# Altium project MSXIV_PowerSelection.PrjPcb (part 2 of 2)

## Sheet Power Selection - AUX.SchDoc: Title
size B; Organization: Midnight Sun Solar Rayce Car Team; Address1: University of Waterloo; Address2: 200 University Ave W; Address3: Waterloo, ON, Canada; Address4: N2L 3E9; Website: www.uwmidsun.com; ProjectName: ProjectName
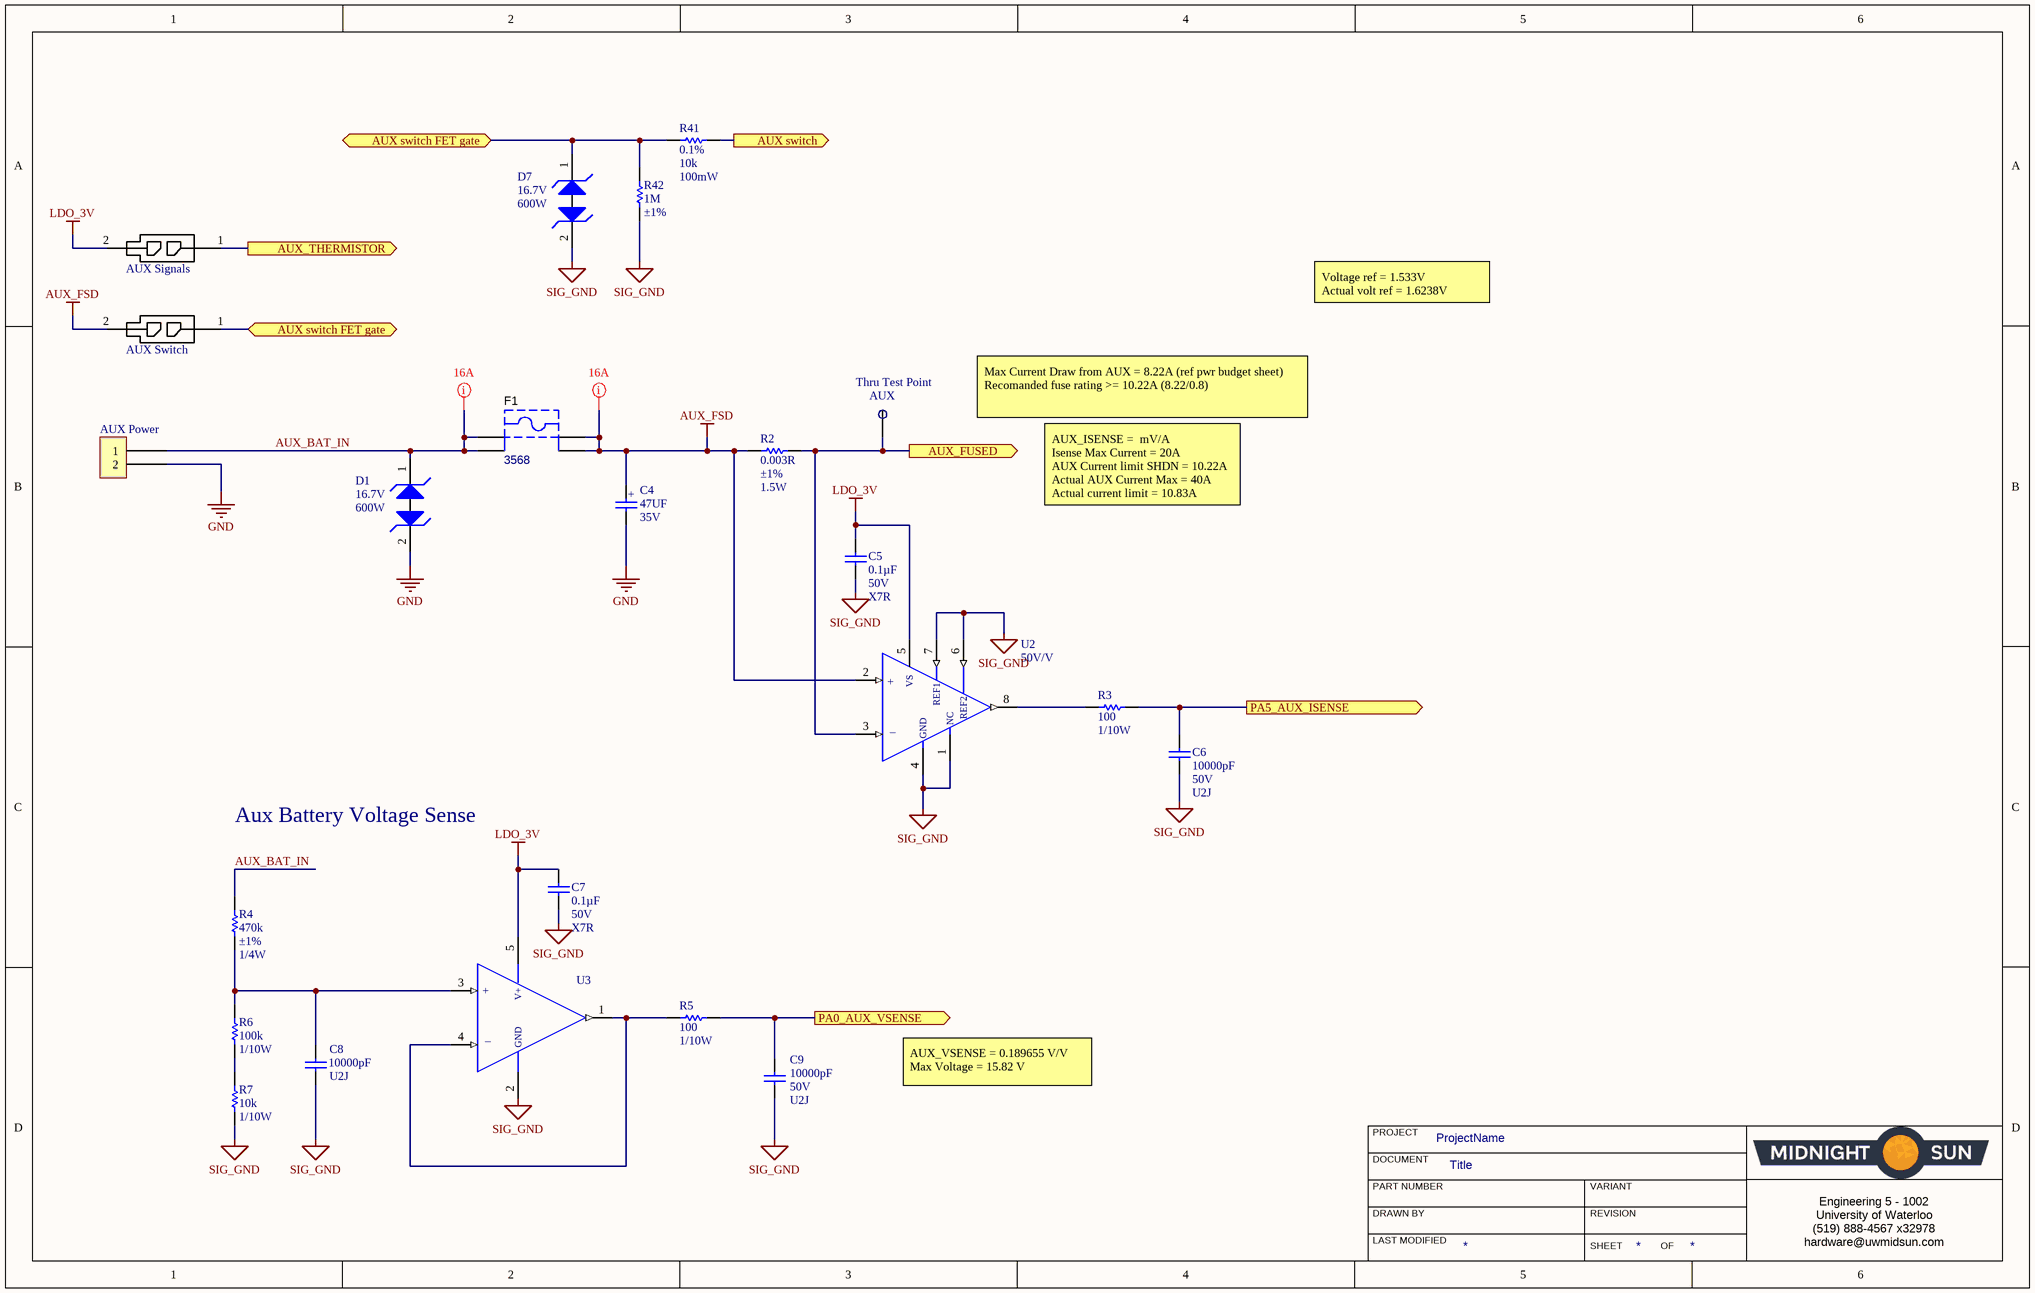
[diagram p3: Power Selection - AUX.SchDoc]

### Parts
AUX  Thru Test Point  [Thru Test Point]
AUX_Power  CONN HEADER TE  ELCON Mini 2POS PCB  [CONN HEADER TE  ELCON Mini 2POS PCB-Footprint-1]  (value not drawn)
AUX_Signals  CONN 2POS MICRO-FIT 3mm  [CONN, 2POS MICRO-FIT]  (value not drawn)
AUX_Switch  CONN 2POS MICRO-FIT 3mm  [CONN, 2POS MICRO-FIT]  (value not drawn)
C4  47UF  Voltage Rating: 35V  [CAP ALUM 6.3MM RADIAL SMD]
C5  Capacitance: 0.1µF  Voltage: 50V  Temperature Coefficient: X7R  [CAP, 0603]  (hidden comment: CAP CER 0.1UF 50V 10% X7R 0603)
C6  Capacitance: 10000pF  Voltage: 50V  Temperature Coefficient: U2J  [CAP, 0603]  (hidden comment: CAP CER 10nF 50V 5% X7R 0603)
C7  Capacitance: 0.1µF  Voltage: 50V  Temperature Coefficient: X7R  [CAP, 0603]  (hidden comment: CAP CER 0.1UF 50V 10% X7R 0603)
C8  Capacitance: 10000pF  Temperature Coefficient: U2J  [CAP, 0603]  (hidden comment: CAP CER 10nF 50V 5% X7R 0603)
C9  Capacitance: 10000pF  Voltage: 50V  Temperature Coefficient: U2J  [CAP, 0603]  (hidden comment: CAP CER 10nF 50V 5% X7R 0603)
D1  Voltage - Breakdown (Min): 16.7V  Power - Peak Pulse: 600W  [DO-214AA Diode]  (hidden comment: DIODE TVS 15VWM 24.4VC DO-214AA (SMB))
D7  Voltage - Breakdown (Min): 16.7V  Power - Peak Pulse: 600W  [DO-214AA Diode]  (hidden comment: DIODE TVS 15VWM 24.4VC DO-214AA (SMB))
F1  3568  [KSTN-3568_V]
R2  Resistance (Ohms): 0.003R  Tolerance: ±1%  Power (Watts): 1.5W  [RES 2010]  (hidden comment: RES 0.003 OHM 1% 1.5W 2010)
R3  Resistance: 100  Power: 1/10W  [RES, 0603]  (hidden comment: RES 100 OHM 1% 1/10W 0603)
R4  Resistance: 470k  Tolerance: ±1%  Power: 1/4W  [RES, 0603]  (hidden comment: RES 470K OHM 1% 1/4W 0603)
R5  Resistance: 100  Power: 1/10W  [RES, 0603]  (hidden comment: RES 100 OHM 1% 1/10W 0603)
R6  Resistance: 100k  Power: 1/10W  [RES, 0603]  (hidden comment: RES 100K OHM 5% 1/8W 0603)
R7  Resistance: 10k  Power: 1/10W  [RES, 0603]  (hidden comment: RES 10K OHM 1% 1/10W 0603)
R41  value 10k  Tolerance: 0.1%  Max Power Dissipation: 100mW  [RES, 0603]  (hidden comment: RES SMD 1K OHM 0.1% 1/10W 0603)
R42  Resistance (Ohms): 1M  Tolerance: ±1%  [RES, 0603]  (hidden comment: RES 1M OHM 1% 1/10W 0603)
U2  50V/V  [IC CURRENT AMPLIFIER INA240 TSSOP-8]
U3  IC OP AMP GEN PURPOSE RR 10MHZ SOT-23-5  [IC OP AMP GP RR 10MHZ SOT-23-5]  (value not drawn)

### Ports
AUX switch (out), AUX switch FET gate (bidir), AUX_FUSED (out), AUX_THERMISTOR (out), PA0_AUX_VSENSE (out), PA5_AUX_ISENSE (out)

### Nets
AUX_FSD: AUX_Switch.2 C4.1 F1.3 F1.4 R2.1 U2.2(+IN)
GND: AUX_Power.2 C4.2 D1.2(Cathode2)
LDO_3V: AUX_Signals.2 C5.1 C7.1 U2.5(VS) U3.5(VDD)
SIG_GND: C5.2 C6.2 C7.2 C8.2 C9.2 D7.2(Cathode2) R7.2 R42.2 U2.1(NC) U2.4(GND) U2.6(REF2) U2.7(REF1) U3.2(VSS)
AUX_BAT_IN: AUX_Power.1 D1.1(Cathode1) F1.1 F1.2 R4.1
AUX_FUSED: AUX.TH_TP R2.2 U2.3(-IN) ; port AUX_FUSED
PA0_AUX_VSENSE: C9.1 R5.2 ; port PA0_AUX_VSENSE
PA5_AUX_ISENSE: C6.1 R3.2 ; port PA5_AUX_ISENSE
NetAUX_Signals_1: AUX_Signals.1 ; port AUX_THERMISTOR
NetAUX_Switch_1: AUX_Switch.1 D7.1(Cathode1) R41.1 R42.1 ; port AUX switch FET gate
NetC8_1: C8.1 R4.2 R6.1 U3.3(+IN)
NetQ14_1: R41.2 ; port AUX switch
NetR3_1: R3.1 U2.8(OUTPUT)
NetR5_1: R5.1 U3.1(OUTPUT) U3.4(-IN)
NetR6_2: R6.2 R7.1

### Layout directives
net class HighCurrent; rule Power Plane Connect Style [Style - Direct Connect]; rule Polygon Connect Style [Style - Direct Connect]: AUX_BAT_IN, AUX_FSD

### Notes on the sheet
- Voltage ref = 1.533V
  Actual volt ref = 1.6238V
- Max Current Draw from AUX = 8.22A (ref pwr budget sheet)
  Recomanded fuse rating >= 10.22A (8.22/0.8)
- AUX_ISENSE =  mV/A
  Isense Max Current = 20A
  AUX Current limit SHDN = 10.22A
  Actual AUX Current Max = 40A
  Actual current limit = 10.83A
- Aux Battery Voltage Sense
- AUX_VSENSE = 0.189655 V/V
  Max Voltage = 15.82 V
- PROJECT
- DOCUMENT
- DRAWN BY
- LAST MODIFIED
- PART NUMBER
- REVISION
- SHEET
- VARIANT
- OF
- Engineering 5 - 1002
  University of Waterloo
  (519) 888-4567 x32978
  hardware@uwmidsun.com
- (in symbol CAP ALUM 47UF 20% 35V SMD) +
- (in symbol IC CURRENT AMPLIFIER INA240 8-TSSOP) +; _
- (in symbol IC OP AMP GEN PURPOSE RR 10MHZ SOT-23-5) V+; +; GND; _

### Library data of the parts
AUX_Power = CMP-002-00071-4: CONN HEADER 2POS PCB; Contact Current Rating: 40A; Number of Contacts: 2; Pitch: 7.8mm; Contact Retention: Yes (With); Sealable: No (Without); Current Rating: 45A; Circuit Application: Power; Gender: Male; Connector Type: Pin; PCB Mounting Orientation: Vertical; Number of Ports: 1; Connector System: Wire-to-Board; Number of Rows: 1; Contact Plating: Silver; Housing Color: Black; Length: 18.9mm; Package Quantity: 150; Number of Terminals: 4; Orientation: Straight; REACH SVHC: Unknown; Contact Material: Copper Alloy,Copper; Housing Material: Polymer; Depth: 10.2mm; Row Spacing: 7.8mm; Termination: Through Hole; Min Operating Temperature: -40°C; Number of Positions: 2; Contact Gender: Male; Packaging: Tape and Reel; Mount: Through Hole; Number of Power Positions: 2; Radiation Hardening: No; Flammability Rating: UL94 V-0; Max Operating Temperature: 125°C
AUX_Signals AUX_Switch = CONN 2POS MICRO-FIT 3mm: Connector Header Through Hole 2 position; Manufacturer: Molex; Manufacturer Part Number: 43045-0227; Number of Positions: 2; Gender: Male; Contact Resistance: 10mR; Number of Ports: 1; Max Voltage Rating (DC): 250.25kV; Current Rating: 5A; Voltage Rating: 600V; Glow Wire Compliant: Compliant; Supplier 1: Digi-Key; Stock 1: 3657; Pricing 1: 1=0.84, 10=0.74, 25=0.6968, 50=0.6676, 100=0.6387, 250=0.5806, 500=0.52254, 1000=0.46448, 2500=0.42094 (USD); Mount: Through Hole; Contact Plating: Tin; Contact Material: Brass; Housing Colour: Black; Housing Material: Thermoplastic; Number of Terminals: 2; Min Operating Temperature: -40°C; Max Operating Temperature: 105°C; Number of Rows: 2; Packaging: Tray; Termination: Solder; Number of Contacts: 2; Orientation: Vertical; Package Quantity: 3168; Number of Circuits: 2; Length: 7.15mm; Pitch: 3mm; Depth: 8.77mm; Row Spacing: 3mm; Radiation Hardening: No; Halogen Free: Low Halogen; ComponentLink1URL: http://www.onlinecomponents.com/productFiles/mf-MOL/307170430450227_pcb_headers.pdf; ComponentLink1Description: http://www.onlinecomponents.com/productFiles/mf-MOL/307170430450227_pcb_headers.pdf; ComponentLink2URL: http://www.mouser.com/ds/2/276/0430450227_PCB_HEADERS-142611.pdf; ComponentLink2Description: http://www.mouser.com/ds/2/276/0430450227_PCB_HEADERS-142611.pdf; ComponentLink3URL: http://uk.rs-online.com/webdocs/13c3/0900766b813c3a46.pdf; ComponentLink3Description: http://uk.rs-online.com/webdocs/13c3/0900766b813c3a46.pdf; ComponentLink4URL: http://www.molex.com/webdocs/datasheets/pdf/en-us/0430450227_PCB_HEADERS.pdf; ComponentLink4Description: http://www.molex.com/webdocs/datasheets/pdf/en-us/0430450227_PCB_HEADERS.pdf; Supplier Part Number 1: WM10657-ND
C4 = CAP ALUM 47UF 20% 35V SMD: 47µF 35V Aluminum Electrolytic Capacitors Radial, Can - SMD 1000 Hrs @ 85°C; Manufacturer: Panasonic; Manufacturer Part Number: EEE-1VA470WP; Tolerance: 20%; Ripple Current: 70mA; Life (Hours): 1000Hour; Supplier 1: Digi-Key; Stock 1: 2820; Pricing 1: 1=0.38, 10=0.263, 100=0.1579, 500=0.11846 (USD); Mount: Surface Mount,PCB; Case/Package: Radial; Contact Plating: Tin; Min Operating Temperature: -40°C; Max Operating Temperature: 85°C; Capacitance: 47uF; Voltage Rating (DC): 35V; Packaging: Tape and Reel; Package Quantity: 1; Ripple Current (AC): 70mA; Termination: SMD/SMT; Diameter: 6.3mm; Length: 5.5mm; Height: 5.4mm; Height - Seated (Max): 0.213inch; Radiation Hardening: No; REACH SVHC: Unknown; Lead Free: Lead Free; ComponentLink1URL: https://datasheet.ciiva.com/2983/aba0000ce2-2983926.pdf; ComponentLink1Description: https://datasheet.ciiva.com/2983/aba0000ce2-2983926.pdf; ComponentLink2URL: https://datasheet.ciiva.com/2983/aba0000ce2-2983927.pdf; ComponentLink2Description: https://datasheet.ciiva.com/2983/aba0000ce2-2983927.pdf; ComponentLink3URL: https://datasheet.ciiva.com/14598/70255710-14598937.pdf; ComponentLink3Description: https://datasheet.ciiva.com/14598/70255710-14598937.pdf; ComponentLink4URL: https://datasheet.ciiva.com/15165/getdatasheetpartid-86239-15165868.pdf; ComponentLink4Description: https://datasheet.ciiva.com/15165/getdatasheetpartid-86239-15165868.pdf; ComponentLink5URL: https://datasheet.ciiva.com/16507/aba0000ce2-16507965.pdf; ComponentLink5Description: https://datasheet.ciiva.com/16507/aba0000ce2-16507965.pdf; ComponentLink6URL: https://datasheet.ciiva.com/30206/11aba0000ce2-30206253.pdf; ComponentLink6Description: https://datasheet.ciiva.com/30206/11aba0000ce2-30206253.pdf; Supplier Part Number 1: PCE3961CT-ND
C5 C7 = CAP CER 0.1UF 50V 10% X7R 0603: 0.10µF ±10% 50V Ceramic Capacitor X7R 0603 (1608 Metric); Manufacturer 1: AVX Corporation; Manufacturer Part Number 1: 06035C104KAT2A; Supplier 1: Digi-Key; Supplier Part Number 1: 478-5052-1-ND; Packaging: Cut Tape (CT); Part Status: Active; Operating Temperature: -55°C ~ 125°C; Ratings: -; Mounting Type: Surface Mount, MLCC; Package / Case: 0603 (1608 Metric); Size / Dimension: 0.063" L x 0.032" W (1.60mm x 0.81mm); Height - Seated (Max): -; Thickness (Max): 0.035" (0.90mm); Lead Spacing: -; Lead Style: -; ComponentLink1URL: http://datasheets.avx.com/X7RDielectric.pdf; ComponentLink1Description: http://datasheets.avx.com/X7RDielectric.pdf; Tolerance: ±10%
C6 C8 C9 = CAP CER 10nF 50V 5% X7R 0603: 10000pF ±5% 50V Ceramic Capacitor U2J 0603 (1608 Metric); Manufacturer 1: KEMET; Manufacturer Part Number 1: C0603C103J5JAC7867; Supplier 1: Digi-Key; Supplier Part Number 1: 399-13384-1-ND; Packaging: Cut Tape (CT); Part Status: Active; Operating Temperature: -55°C ~ 125°C; Ratings: -; Failure Rate: -; Mounting Type: Surface Mount, MLCC; Package / Case: 0603 (1608 Metric); Size / Dimension: 0.063" L x 0.032" W (1.60mm x 0.80mm); Height - Seated (Max): -; Thickness (Max): 0.034" (0.87mm); Lead Spacing: -; Lead Style: -; ComponentLink1URL: http://www.kemet.com/docfinder?Partnumber=C0603C103J5JAC7867; ComponentLink1Description: http://www.kemet.com/docfinder?Partnumber=C0603C103J5JAC7867; Tolerance: ±5%
  C8: Voltage: 50V
D1 D7 = DIODE TVS 15VWM 24.4VC DO-214AA (SMB): TVS DIODE 15VWM 24.4VC SMB; Manufacturer 1: Fairchild/ON Semiconductor; Manufacturer Part Number 1: SMBJ15CA; Type: Zener; Voltage - Reverse Standoff (Typ): 15V; Voltage - Clamping (Max) @ Ipp: 24.4V; Current - Peak Pulse (10/1000µs): 24.6A; Power Line Protection: No; Supplier 1: Digi-Key; Supplier Part Number 1: SMBJ15CAFSCT-ND; RoHS: RoHS Compliant; Description 1: TVS DIODE 15VWM 24.4VC SMB; Category: Circuit Protection; Stock 1: 24965; Pricing 1: 1=0.54, 10=0.444, 100=0.3027, 500=0.22704, 1000=0.17028 (CAD); Packaging: Cut Tape (CT); Part Status: Active; Applications: General Purpose; Capacitance @ Frequency: -; Operating Temperature: -55°C ~ 150°C (TJ); Mounting Type: Surface Mount; Package / Case: DO-214AA, SMB; Supplier Device Package: DO-214AA (SMB); ComponentLink1URL: https://www.fairchildsemi.com/datasheets/SM/SMBJ10CA.pdf; ComponentLink1Description: https://www.fairchildsemi.com/datasheets/SM/SMBJ10CA.pdf
F1 = CMP-005-00014-1: Fuse Holder 20A 500VAC Pin Through Hole; Illumination Type: Illuminated; Number of Poles: 1; Voltage: 500V; Color: Black; Approvals: UL; Fuse Type: Automotive; Body Material: Nylon; Material: Brass,Tin,Nylon; Fuse Current: 20A; REACH SVHC: No SVHC; Depth: 6.73mm; Current Rating: 20A; Length: 16mm; Flammability Rating: UL94 V-0; Mount: PCB,Vertical; Voltage Rating (AC): 500V; Contact Plating: Tin; Max Operating Temperature: 145°C; Min Operating Temperature: -50°C; Lead Free: Lead Free; Package Quantity: 1; Number of Circuits: 1; Termination: PC Pin; Orientation: Vertical; Contact Material: Brass,Tin
R2 = RES 0.003 OHM 1% 1.5W 2010: 0.003 Ohm ±1% 1.5W Chip Resistor 2010 (5025 Metric) Current Sense, Moisture Resistant Metal Foil; Manufacturer 1: Stackpole Electronics Inc.; Manufacturer Part Number 1: CSNL2010FT3L00; Description 1: RES SMD 0.003 OHM 1% 1.5W 2010; Temperature Coefficient: ±50ppm/°C; Supplier 1: Digi-Key; Supplier Part Number 1: CSNL2010FT3L00CT-ND; RoHS: RoHS Compliant; Category: Resistors; Stock 1: 18532; Pricing 1: 1=1.02, 10=0.844, 25=0.7232, 50=0.6508, 100=0.5665, 250=0.5062, 500=0.4098, 1000=0.33145 (CAD); Packaging: Cut Tape (CT); Part Status: Active; Composition: Metal Foil; Features: Current Sense, Moisture Resistant; Operating Temperature: -55°C ~ 170°C; Package / Case: 2010 (5025 Metric); Supplier Device Package: 2010; Size / Dimension: 0.200" L x 0.100" W (5.08mm x 2.54mm); Height - Seated (Max): 0.041" (1.04mm); Failure Rate: -; ComponentLink1URL: https://www.seielect.com/Catalog/SEI-csnl.pdf; ComponentLink1Description: https://www.seielect.com/Catalog/SEI-csnl.pdf
R3 R5 = RES 100 OHM 1% 1/10W 0603: 100 Ohm ±1% 0.1W, 1/10W Chip Resistor 0603 (1608 Metric) Moisture Resistant Thick Film; Manufacturer 1: Yageo; Manufacturer Part Number 1: RC0603FR-07100RL; Temperature Coefficient: ±100ppm/°C; Supplier 1: Digi-Key; Supplier Part Number 1: 311-100HRCT-ND; Packaging: Cut Tape (CT); Part Status: Active; Composition: Thick Film; Operating Temperature: -55°C ~ 155°C; Package / Case: 0603 (1608 Metric); Supplier Device Package: 0603; Size / Dimension: 0.063" L x 0.031" W (1.60mm x 0.80mm); Height - Seated (Max): 0.022" (0.55mm); Failure Rate: -; ComponentLink1URL: http://www.yageo.com/documents/recent/PYu-RC_Group_51_RoHS_L_7.pdf; ComponentLink1Description: http://www.yageo.com/documents/recent/PYu-RC_Group_51_RoHS_L_7.pdf; Tolerance: ±1%
R4 = RES 470K OHM 1% 1/4W 0603: RES SMD 470K OHM 1% 1/4W 0603; Manufacturer 1: Panasonic Electronic Components; Manufacturer Part Number 1: ERJ-PA3F4703V; Temperature Coefficient: ±100ppm/°C; Supplier 1: Digi-Key; Supplier Part Number 1: P470KBYCT-ND; Packaging: Cut Tape (CT); Part Status: Active; Composition: Thick Film; Operating Temperature: -55°C ~ 155°C; Package / Case: 0603 (1608 Metric); Supplier Device Package: 0603; Size / Dimension: 0.063" L x 0.031" W (1.60mm x 0.80mm); Height - Seated (Max): 0.022" (0.55mm); Failure Rate: -; ComponentLink1URL: https://industrial.panasonic.com/cdbs/www-data/pdf/RDO0000/AOA0000C291.pdf; ComponentLink1Description: https://industrial.panasonic.com/cdbs/www-data/pdf/RDO0000/AOA0000C291.pdf
R6 = RES 100K OHM 5% 1/8W 0603: RES SMD 100K OHM 5% 1/10W 0603; Manufacturer 1: Yageo; Manufacturer Part Number 1: RC0603JR-07100KL; Temperature Coefficient: ±100ppm/°C; Supplier 1: Digi-Key; Supplier Part Number 1: 311-100KGRCT-ND; Packaging: Cut Tape (CT); Part Status: Active; Composition: Thick Film; Operating Temperature: -55°C ~ 155°C; Package / Case: 0603 (1608 Metric); Supplier Device Package: 0603; Size / Dimension: 0.063" L x 0.031" W (1.60mm x 0.80mm); Height - Seated (Max): 0.022" (0.55mm); Failure Rate: -; ComponentLink1URL: http://www.yageo.com/documents/recent/PYu-RC_Group_51_RoHS_L_7.pdf; ComponentLink1Description: http://www.yageo.com/documents/recent/PYu-RC_Group_51_RoHS_L_7.pdf; Tolerance: ±5%
R7 = RES 10K OHM 1% 1/10W 0603: RES SMD 10K OHM 1% 1/10W 0603; Manufacturer 1: Yageo; Manufacturer Part Number 1: RC0603FR-0710KL; Temperature Coefficient: ±100ppm/°C; Supplier 1: Digi-Key; Supplier Part Number 1: 311-10.0KHRCT-ND; Packaging: Cut Tape (CT); Part Status: Active; Composition: Thick Film; Operating Temperature: -55°C ~ 155°C; Package / Case: 0603 (1608 Metric); Supplier Device Package: 0603; Size / Dimension: 0.063" L x 0.031" W (1.60mm x 0.80mm); Height - Seated (Max): 0.022" (0.55mm); Failure Rate: -; ComponentLink1URL: http://www.yageo.com/documents/recent/PYu-RC_Group_51_RoHS_L_7.pdf; ComponentLink1Description: http://www.yageo.com/documents/recent/PYu-RC_Group_51_RoHS_L_7.pdf; Tolerance: ±1%
R41 = CMP-010-0039-1: 1 kOhms ��0.1% 0.1W, 1/10W Chip Resistor 0603 (1608 Metric) Automotive AEC-Q200 Thin Film; Manufacturer: Panasonic; Manufacturer Part Number: ERA3AEB103V; Voltage Rating: 75V; Temperature Coefficient: 25ppm/��C; Power Rating: 100mW; Number of Terminations: 2; Mount: Surface Mount; Packaging: Tape and Reel; RoHS: Yes; Termination: SMD/SMT; ComponentLink7Description: http://www.farnell.com/datasheets/2059650.pdf; Military Standard: Not; Stock 1: 2747820; ComponentLink6URL: http://uk.rs-online.com/webdocs/148c/0900766b8148c4ab.pdf; Lead Free: Lead Free; Pins: 2; ComponentLink4Description: http://www.farnell.com/datasheets/2052875.pdf; Source: Schematic Diagrams.SchLib; Case Code (Metric): 1608; ComponentLink3URL: http://industrial.panasonic.com/www-data/pdf/AOA0000/AOA0000CE26.pdf; ComponentLink8URL: http://www.produktinfo.conrad.com/datenblaetter/450000-474999/451250-da-01-en-WIDERSTAND_0603_ERA.pdf; Depth: 0.8mm; Max Operating Temperature: 155��C; Case/Package: 0603; ComponentLink2Description: http://www.farnell.com/datasheets/485442.pdf; Package Quantity: 5000; Contact Plating: Tin; Width: 0.8mm; ComponentLink7URL: http://www.farnell.com/datasheets/2059650.pdf; Design Item ID: RES SMD 1K OHM 0.1% 1/10W 0603; ComponentLink4URL: http://www.farnell.com/datasheets/2052875.pdf; Radiation Hardening: No; Pricing 1: 1 = 0.35000, 10 = 0.30000, 100 = 0.11720, 1000 = 0.04906, 2500 = 0.04498 (USD); ComponentLink5URL: http://www.farnell.com/datasheets/1776116.pdf; Height: 0.45mm; ComponentLink2URL: http://www.farnell.com/datasheets/485442.pdf; ComponentLink3Description: http://industrial.panasonic.com/www-data/pdf/AOA0000/AOA0000CE26.pdf; ComponentLink1Description: Digikey; ComponentLink8Description: http://www.produktinfo.conrad.com/datenblaetter/450000-474999/451250-da-01-en-WIDERSTAND_0603_ERA.pdf; Voltage Rating (DC): 75V; ComponentLink5Description: http://www.farnell.com/datasheets/1776116.pdf; Composition: Metal Film,Thin Film; Min Operating Temperature: -55��C; Length: 1.6mm; REACH SVHC: No SVHC; ComponentLink6Description: http://uk.rs-online.com/webdocs/148c/0900766b8148c4ab.pdf; ComponentLink1URL: https://www.digikey.ca/product-detail/en/panasonic-electronic-components/ERA-3AEB102V/P1.0KDBCT-ND/1466052
R42 = RES 1M OHM 1% 1/10W 0603: 1M Ohm ±1% 0.1W, 1/10W Chip Resistor 0603 (1608 Metric) Moisture Resistant Thick Film; Manufacturer 1: Yageo; Manufacturer Part Number 1: RC0603FR-071ML; Description 1: RES SMD 1M OHM 1% 1/10W 0603; Temperature Coefficient: ±100ppm/°C; Supplier 1: Digi-Key; Supplier Part Number 1: 311-1.00MHRCT-ND; RoHS: RoHS Compliant; Category: Resistors; Stock 1: 2336711; Pricing 1: 1=0.16, 10=0.022, 100=0.0089, 1000=0.00402, 2500=0.00349 (CAD); Packaging: Cut Tape (CT); Part Status: Active; Composition: Thick Film; Features: Moisture Resistant; Operating Temperature: -55°C ~ 155°C; Package / Case: 0603 (1608 Metric); Supplier Device Package: 0603; Size / Dimension: 0.063" L x 0.031" W (1.60mm x 0.80mm); Height - Seated (Max): 0.022" (0.55mm); Failure Rate: -; ComponentLink1URL: http://www.yageo.com/documents/recent/PYu-RC_Group_51_RoHS_L_7.pdf; ComponentLink1Description: http://www.yageo.com/documents/recent/PYu-RC_Group_51_RoHS_L_7.pdf
U2 = IC CURRENT AMPLIFIER INA240 8-TSSOP: Current Sense Amplifier 1 Circuit 8-TSSOP; Manufacturer 1: Texas Instruments; Manufacturer Part Number 1: INA240A3PWR; Description 1: IC AMP CURRENT SENSE 8-TSSOP; Slew Rate: 2 V/µs; Current - Supply: 1.8mA; Voltage - Supply, Single/Dual (±): 2.7 V ~ 5.5 V; Supplier 1: Digi-Key; Supplier Part Number 1: 296-45090-1-ND; RoHS: RoHS Compliant; Category: Integrated Circuits (ICs); Stock 1: 1286; Pricing 1: 1=3.79, 10=3.397, 100=2.7311, 500=2.24388, 1000=1.85921 (CAD); Packaging: Cut Tape (CT); Part Status: Active; Amplifier Type: Current Sense; Output Type: -; Operating Temperature: -40°C ~ 125°C; Mounting Type: Surface Mount; Package / Case: 8-TSSOP (0.173", 4.40mm Width); Supplier Device Package: 8-TSSOP; ComponentLink1URL: http://www.ti.com/lit/ds/symlink/ina240.pdf; ComponentLink1Description: http://www.ti.com/lit/ds/symlink/ina240.pdf
U3 = IC OP AMP GEN PURPOSE RR 10MHZ SOT-23-5: General Purpose Amplifier 1 Circuit Rail-to-Rail SOT-23-5; Manufacturer 1: Texas Instruments; Manufacturer Part Number 1: TLV316QDBVRQ1; Description 1: IC OP AMP GP RR 10MHZ 5-SOT-23; Number of Circuits: 1; Slew Rate: 6 V/µs; Current - Supply: 400µA; Current - Output / Channel: 50mA; Voltage - Supply, Single/Dual (±): 1.8 V ~ 5.5 V, ±0.9 V ~ 2.75 V; Supplier 1: Digi-Key; Supplier Part Number 1: 296-45323-1-ND; RoHS: RoHS Compliant; Category: Integrated Circuits (ICs); Stock 1: 1747; Pricing 1: 1=1.33, 10=1.185, 100=0.9234, 500=0.76276, 1000=0.60218 (CAD); Packaging: Cut Tape (CT); Part Status: Active; Amplifier Type: General Purpose; Output Type: Rail-to-Rail; -3db Bandwidth: -; Operating Temperature: -40°C ~ 125°C; Mounting Type: Surface Mount; Package / Case: SC-74A, SOT-753; Supplier Device Package: SOT-23-5; ComponentLink1URL: http://www.ti.com/lit/ds/symlink/tlv316-q1.pdf; ComponentLink1Description: http://www.ti.com/lit/ds/symlink/tlv316-q1.pdf

## Sheet Power Selection - Temperature Sense.SchDoc: Title
size B; Organization: Midnight Sun Solar Rayce Car Team; Address1: University of Waterloo; Address2: 200 University Ave W; Address3: Waterloo, ON, Canada; Address4: N2L 3E9; Website: www.uwmidsun.com; ProjectName: ProjectName
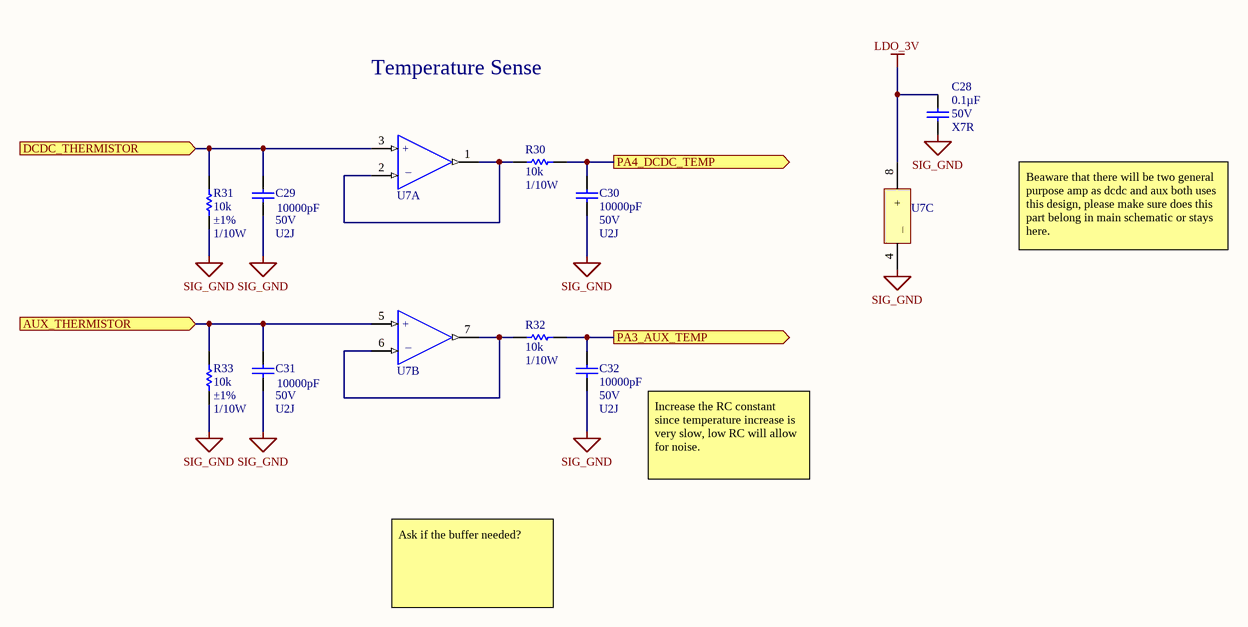
[diagram p4: Power Selection - Temperature Sense.SchDoc]

### Parts
C28  Capacitance: 0.1µF  Voltage: 50V  Temperature Coefficient: X7R  [CAP, 0603]  (hidden comment: CAP CER 0.1UF 50V 10% X7R 0603)
C29  Capacitance: 10000pF  Voltage: 50V  Temperature Coefficient: U2J  [CAP, 0603]  (hidden comment: CAP CER 10nF 50V 5% X7R 0603)
C30  Capacitance: 10000pF  Voltage: 50V  Temperature Coefficient: U2J  [CAP, 0603]  (hidden comment: CAP CER 10nF 50V 5% X7R 0603)
C31  Capacitance: 10000pF  Voltage: 50V  Temperature Coefficient: U2J  [CAP, 0603]  (hidden comment: CAP CER 10nF 50V 5% X7R 0603)
C32  Capacitance: 10000pF  Voltage: 50V  Temperature Coefficient: U2J  [CAP, 0603]  (hidden comment: CAP CER 10nF 50V 5% X7R 0603)
R30  Resistance: 10k  Power: 1/10W  [RES, 0603]  (hidden comment: RES 10K OHM 1% 1/10W 0603)
R31  Resistance: 10k  Tolerance: ±1%  Power: 1/10W  [RES, 0603]  (hidden comment: RES 10K OHM 1% 1/10W 0603)
R32  Resistance: 10k  Power: 1/10W  [RES, 0603]  (hidden comment: RES 10K OHM 1% 1/10W 0603)
R33  Resistance: 10k  Tolerance: ±1%  Power: 1/10W  [RES, 0603]  (hidden comment: RES 10K OHM 1% 1/10W 0603)
U7  IC OP AMP DUAL GP RR 10MHZ 8-VSSOP  [IC DUAL OPAMP OPA2197 8-VSSOP]  (value not drawn)  (parts A,B,C of 3)

### Ports
AUX_THERMISTOR (in), DCDC_THERMISTOR (in), PA3_AUX_TEMP (out), PA4_DCDC_TEMP (out)

### Nets
LDO_3V: C28.1 U7.8(+)
SIG_GND: C28.2 C29.2 C30.2 C31.2 C32.2 R31.2 R33.2 U7.4(_)
PA3_AUX_TEMP: C32.1 R32.2 ; port PA3_AUX_TEMP
PA4_DCDC_TEMP: C30.1 R30.2 ; port PA4_DCDC_TEMP
NetAUX_Signals_1: C31.1 R33.1 U7.5(+IN_B) ; port AUX_THERMISTOR
NetC29_1: C29.1 R31.1 U7.3(+IN_A) ; port DCDC_THERMISTOR
NetR30_1: R30.1 U7.1(OUT_A) U7.2(-IN_A)
NetR32_1: R32.1 U7.6(-IN_B) U7.7(OUT_B)

### Notes on the sheet
- Temperature Sense
- Beaware that there will be two general purpose amp as dcdc and aux both uses this design, please make sure does this part belong in main schematic or stays here.
- Increase the RC constant since temperature increase is very slow, low RC will allow for noise.
- Ask if the buffer needed?
- PROJECT
- DOCUMENT
- DRAWN BY
- LAST MODIFIED
- PART NUMBER
- REVISION
- SHEET
- VARIANT
- OF
- Engineering 5 - 1002
  University of Waterloo
  (519) 888-4567 x32978
  hardware@uwmidsun.com

### Library data of the parts
C28 = CAP CER 0.1UF 50V 10% X7R 0603: as C5 on sheet Power Selection - AUX; Supplier 1: Digi-Key; Supplier Part Number 1: 478-5052-1-ND; Packaging: Cut Tape (CT); Part Status: Active; Operating Temperature: -55°C ~ 125°C; Ratings: -; Mounting Type: Surface Mount, MLCC; Package / Case: 0603 (1608 Metric); Size / Dimension: 0.063" L x 0.032" W (1.60mm x 0.81mm); Height - Seated (Max): -; Thickness (Max): 0.035" (0.90mm); Lead Spacing: -; Lead Style: -; ComponentLink1URL: http://datasheets.avx.com/X7RDielectric.pdf; ComponentLink1Description: http://datasheets.avx.com/X7RDielectric.pdf; Tolerance: ±10%
C29-C32 = CAP CER 10nF 50V 5% X7R 0603: as C6 on sheet Power Selection - AUX; Supplier 1: Digi-Key; Supplier Part Number 1: 399-13384-1-ND; Packaging: Cut Tape (CT); Part Status: Active; Operating Temperature: -55°C ~ 125°C; Ratings: -; Failure Rate: -; Mounting Type: Surface Mount, MLCC; Package / Case: 0603 (1608 Metric); Size / Dimension: 0.063" L x 0.032" W (1.60mm x 0.80mm); Height - Seated (Max): -; Thickness (Max): 0.034" (0.87mm); Lead Spacing: -; Lead Style: -; ComponentLink1URL: http://www.kemet.com/docfinder?Partnumber=C0603C103J5JAC7867; ComponentLink1Description: http://www.kemet.com/docfinder?Partnumber=C0603C103J5JAC7867; Tolerance: ±5%
R30-R33 = RES 10K OHM 1% 1/10W 0603: as R7 on sheet Power Selection - AUX; Supplier 1: Digi-Key; Supplier Part Number 1: 311-10.0KHRCT-ND; Packaging: Cut Tape (CT); Part Status: Active; Composition: Thick Film; Operating Temperature: -55°C ~ 155°C; Package / Case: 0603 (1608 Metric); Supplier Device Package: 0603; Size / Dimension: 0.063" L x 0.031" W (1.60mm x 0.80mm); Height - Seated (Max): 0.022" (0.55mm); Failure Rate: -; ComponentLink1URL: http://www.yageo.com/documents/recent/PYu-RC_Group_51_RoHS_L_7.pdf; ComponentLink1Description: http://www.yageo.com/documents/recent/PYu-RC_Group_51_RoHS_L_7.pdf
  R30 R32: Tolerance: ±1%
U7 = IC OP AMP DUAL GP RR 10MHZ 8-VSSOP: General Purpose Amplifier 2 Circuit Rail-to-Rail 8-VSSOP; Manufacturer: Texas Instruments; Manufacturer Part Number: OPA2197IDGKR; Number of Circuits: 2; Slew Rate: 20V/µs; Input Bias Current: 5pA; Input Offset Voltage (Vos): 250uV; Operating Supply Current: 1mA; Output Current per Channel: 65mA; Supplier 1: Digi-Key; Stock 1: 2171; Pricing 1: 1=2.41, 10=2.162, 100=1.7376, 500=1.4276, 1000=1.1829 (USD); Mount: Surface Mount; Case/Package: VSSOP; Min Operating Temperature: -40°C; Max Operating Temperature: 125°C; Packaging: Tape and Reel; Gain Bandwidth Product: 10MHz; Number of Channels: 2; Lead Free: Lead Free; ComponentLink1URL: http://www.ti.com/lit/ds/symlink/opa2197.pdf; ComponentLink1Description: http://www.ti.com/lit/ds/symlink/opa2197.pdf; Supplier Part Number 1: 296-47349-1-ND

## Sheet Power Selection - Power Path.SchDoc: Title
size B; Organization: Midnight Sun Solar Rayce Car Team; Address1: University of Waterloo; Address2: 200 University Ave W; Address3: Waterloo, ON, Canada; Address4: N2L 3E9; Website: www.uwmidsun.com; ProjectName: ProjectName
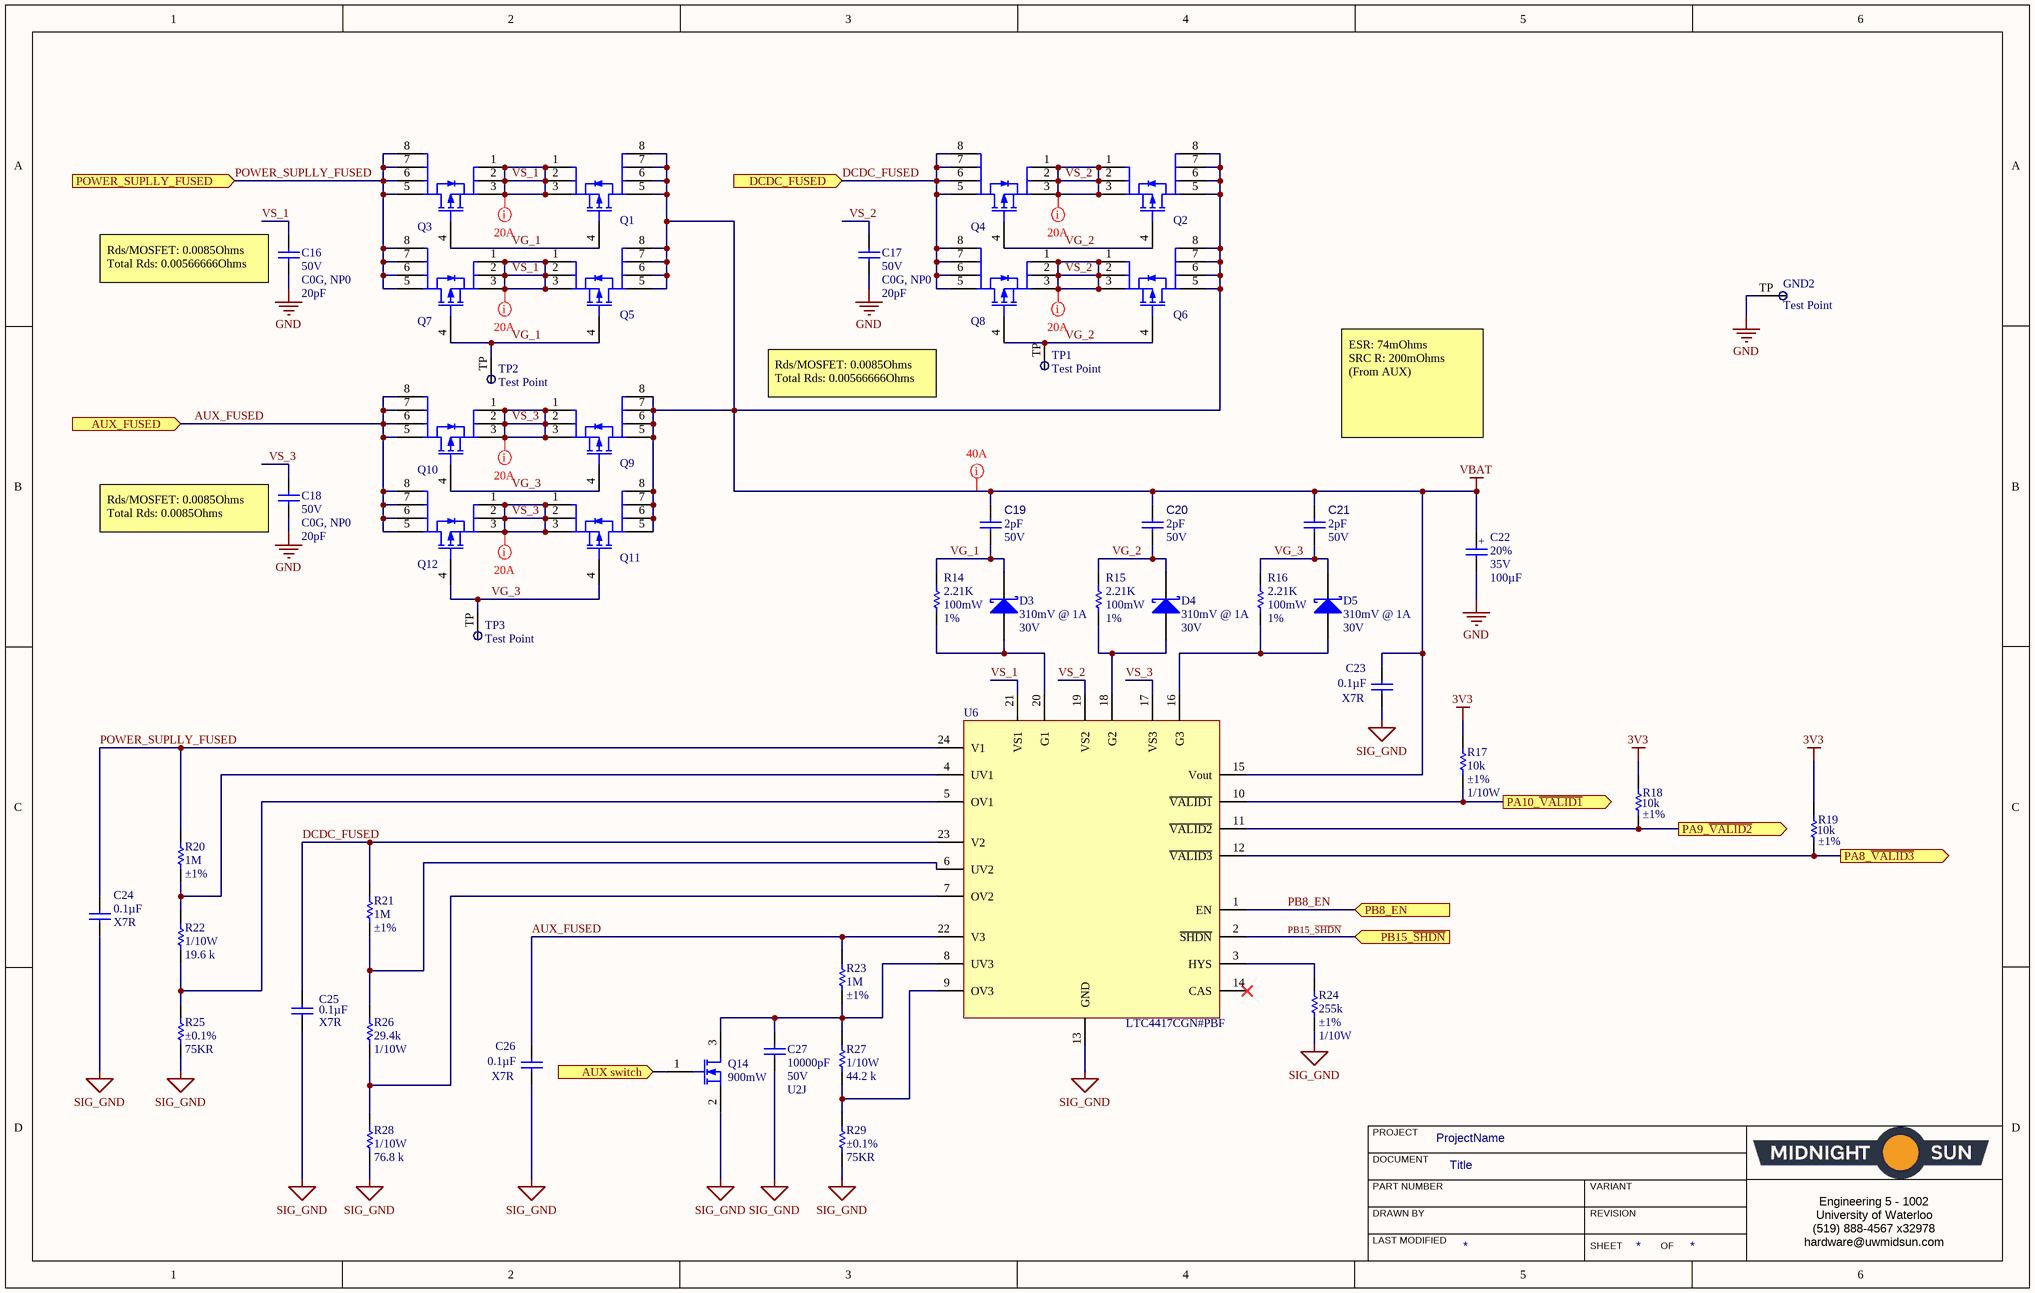
[diagram p5: Power Selection - Power Path.SchDoc]

### Parts
C16  value 20pF  Voltage: 50V  Temperature Coefficient: C0G, NP0  [CAP, 0603]  (hidden comment: CAP CER 20PF 50V ±5% C0G/NP0 0603)
C17  value 20pF  Voltage: 50V  Temperature Coefficient: C0G, NP0  [CAP, 0603]  (hidden comment: CAP CER 20PF 50V ±5% C0G/NP0 0603)
C18  value 20pF  Voltage: 50V  Temperature Coefficient: C0G, NP0  [CAP, 0603]  (hidden comment: CAP CER 20PF 50V ±5% C0G/NP0 0603)
C19  Voltage Rating (DC): 50V  Capacitance: 2pF  [CAP, 0603]  (hidden comment: CAP CER 2PF 50V C0G 0603)
C20  Voltage Rating (DC): 50V  Capacitance: 2pF  [CAP, 0603]  (hidden comment: CAP CER 2PF 50V C0G 0603)
C21  Voltage Rating (DC): 50V  Capacitance: 2pF  [CAP, 0603]  (hidden comment: CAP CER 2PF 50V C0G 0603)
C22  value 100µF  Tolerance: 20%  Voltage Rating: 35V  [CAP ALUM 6.3MM RADIAL SMD]  (hidden comment: CAP ALUM 100UF 20% 35V SMD)
C23  Capacitance: 0.1µF  Temperature Coefficient: X7R  [CAP, 0603]  (hidden comment: CAP CER 0.1UF 50V 10% X7R 0603)
C24  Capacitance: 0.1µF  Temperature Coefficient: X7R  [CAP, 0603]  (hidden comment: CAP CER 0.1UF 50V 10% X7R 0603)
C25  Capacitance: 0.1µF  Temperature Coefficient: X7R  [CAP, 0603]  (hidden comment: CAP CER 0.1UF 50V 10% X7R 0603)
C26  Capacitance: 0.1µF  Temperature Coefficient: X7R  [CAP, 0603]  (hidden comment: CAP CER 0.1UF 50V 10% X7R 0603)
C27  Capacitance: 10000pF  Voltage: 50V  Temperature Coefficient: U2J  [CAP, 0603]  (hidden comment: CAP CER 10nF 50V 5% X7R 0603)
D3  Voltage - Forward (Vf) (Max) @ If: 310mV @ 1A  Voltage - DC Reverse (Vr) (Max): 30V  [DIODE SCHOTTKY 30V 1A POWERDI123]  (hidden comment: DIODE SCHOTTKY 30V 1A POWERDI123)
D4  Voltage - Forward (Vf) (Max) @ If: 310mV @ 1A  Voltage - DC Reverse (Vr) (Max): 30V  [DIODE SCHOTTKY 30V 1A POWERDI123]  (hidden comment: DIODE SCHOTTKY 30V 1A POWERDI123)
D5  Voltage - Forward (Vf) (Max) @ If: 310mV @ 1A  Voltage - DC Reverse (Vr) (Max): 30V  [DIODE SCHOTTKY 30V 1A POWERDI123]  (hidden comment: DIODE SCHOTTKY 30V 1A POWERDI123)
GND2  Test Point  [Test Point]  (no BOM)
Q1  MOSFET P-CH PWR56 40V 4.9 MOHM  [PMOS PWR56 40V 4.9 MOHM]  (value not drawn)
Q2  MOSFET P-CH PWR56 40V 4.9 MOHM  [PMOS PWR56 40V 4.9 MOHM]  (value not drawn)
Q3  MOSFET P-CH PWR56 40V 4.9 MOHM  [PMOS PWR56 40V 4.9 MOHM]  (value not drawn)
Q4  MOSFET P-CH PWR56 40V 4.9 MOHM  [PMOS PWR56 40V 4.9 MOHM]  (value not drawn)
Q5  MOSFET P-CH PWR56 40V 4.9 MOHM  [PMOS PWR56 40V 4.9 MOHM]  (value not drawn)
Q6  MOSFET P-CH PWR56 40V 4.9 MOHM  [PMOS PWR56 40V 4.9 MOHM]  (value not drawn)
Q7  MOSFET P-CH PWR56 40V 4.9 MOHM  [PMOS PWR56 40V 4.9 MOHM]  (value not drawn)
Q8  MOSFET P-CH PWR56 40V 4.9 MOHM  [PMOS PWR56 40V 4.9 MOHM]  (value not drawn)
Q9  MOSFET P-CH PWR56 40V 4.9 MOHM  [PMOS PWR56 40V 4.9 MOHM]  (value not drawn)
Q10  MOSFET P-CH PWR56 40V 4.9 MOHM  [PMOS PWR56 40V 4.9 MOHM]  (value not drawn)
Q11  MOSFET P-CH PWR56 40V 4.9 MOHM  [PMOS PWR56 40V 4.9 MOHM]  (value not drawn)
Q12  MOSFET P-CH PWR56 40V 4.9 MOHM  [PMOS PWR56 40V 4.9 MOHM]  (value not drawn)
Q14  Max Power Dissipation: 900mW  [MOSFET N-CH 30V 6.2A 0.9W SOT-23]  (hidden comment: MOSFET N-CH 30V 6.2A 0.9W SOT-23)
R14  2.21K  Tolerance: 1%  Max Power Dissipation: 100mW  [RES, 0603]
R15  2.21K  Tolerance: 1%  Max Power Dissipation: 100mW  [RES, 0603]
R16  2.21K  Tolerance: 1%  Max Power Dissipation: 100mW  [RES, 0603]
R17  Resistance: 10k  Tolerance: ±1%  Power: 1/10W  [RES, 0603]  (hidden comment: RES 10K OHM 1% 1/10W 0603)
R18  Resistance: 10k  Tolerance: ±1%  [RES, 0603]  (hidden comment: RES 10K OHM 1% 1/10W 0603)
R19  Resistance: 10k  Tolerance: ±1%  [RES, 0603]  (hidden comment: RES 10K OHM 1% 1/10W 0603)
R20  Resistance (Ohms): 1M  Tolerance: ±1%  [RES, 0603]  (hidden comment: RES 1M OHM 1% 1/10W 0603)
R21  Resistance (Ohms): 1M  Tolerance: ±1%  [RES, 0603]  (hidden comment: RES 1M OHM 1% 1/10W 0603)
R22  Power (Watts): 1/10W  Resistance: 19.6 k  [RES, 0603]  (hidden comment: RES 19.6K OHM 1% 1/10W 0603)
R23  Resistance (Ohms): 1M  Tolerance: ±1%  [RES, 0603]  (hidden comment: RES 1M OHM 1% 1/10W 0603)
R24  Resistance (Ohms): 255k  Tolerance: ±1%  Power (Watts): 1/10W  [RES, 0603]  (hidden comment: RES 255K OHM 1% 1/10W 0603)
R25  value 75KR  Tolerance: ±0.1%  [RES, 0603]  (hidden comment: RES SMD 75K OHM 0.1% 1/10W 0603)
R26  Resistance (Ohms): 29.4k  Power (Watts): 1/10W  [RES, 0603]  (hidden comment: RES 29.4K OHM 1% 1/10W 0603)
R27  Power (Watts): 1/10W  Resistance: 44.2 k  [RES, 0603]  (hidden comment: RES SMD 44.2K OHM 1% 1/10W 0603)
R28  Power (Watts): 1/10W  Resistance: 76.8 k  [RES, 0603]  (hidden comment: RES 76.8K OHM 1% 1/10W 0603)
R29  value 75KR  Tolerance: ±0.1%  [RES, 0603]  (hidden comment: RES SMD 75K OHM 0.1% 1/10W 0603)
TP1  Test Point  [Test Point]  (no BOM)
TP2  Test Point  [Test Point]  (no BOM)
TP3  Test Point  [Test Point]  (no BOM)
U6  Manufacturer Part Number 1: LTC4417CGN#PBF  [IC OR CTRLR SRC SELECT 24SSOP]  (hidden comment: IC OR CONTROLLER SOURCE SELECT 24SSOP)

### Ports
AUX switch (in), AUX_FUSED (in), DCDC_FUSED (in), PA8_~{VALID3} (out), PA9_~{VALID2} (out), PA10_~{VALID1} (out), PB8_EN (in), PB15_~{SHDN} (in), POWER_SUPLLY_FUSED (in)

### Nets
3V3: R17.1 R18.1 R19.1
GND: C16.2 C17.2 C18.2 C22.2 GND2.TP
SIG_GND: C23.2 C24.2 C25.2 C26.2 C27.2 Q14.2(S) R24.2 R25.1 R28.2 R29.2 U6.13(GND)
VBAT: C19.2 C20.2 C21.2 C22.1 C23.1 Q1.5(D) Q1.6(D) Q1.7(D) Q1.8(D) Q2.5(D) Q2.6(D) Q2.7(D) Q2.8(D) Q5.5(D) Q5.6(D) Q5.7(D) Q5.8(D) Q6.5(D) Q6.6(D) Q6.7(D) Q6.8(D) Q9.5(D) Q9.6(D) Q9.7(D) Q9.8(D) Q11.5(D) Q11.6(D) Q11.7(D) Q11.8(D) U6.15(Vout)
AUX_FUSED: C26.1 Q10.5(D) Q10.6(D) Q10.7(D) Q10.8(D) Q12.5(D) Q12.6(D) Q12.7(D) Q12.8(D) R23.1 U6.22(V3) ; port AUX_FUSED
DCDC_FUSED: C25.1 Q4.5(D) Q4.6(D) Q4.7(D) Q4.8(D) Q8.5(D) Q8.6(D) Q8.7(D) Q8.8(D) R21.1 U6.23(V2) ; port DCDC_FUSED
PA8_~{VALID3}: R19.2 U6.12(~{VALID3}) ; port PA8_~{VALID3}
PA9_~{VALID2}: R18.2 U6.11(~{VALID2}) ; port PA9_~{VALID2}
PA10_~{VALID1}: R17.2 U6.10(~{VALID1}) ; port PA10_~{VALID1}
PB8_EN: U6.1(EN) ; port PB8_EN  [project net PA8_EN]
PB15_~{SHDN}: U6.2(~{SHDN}) ; port PB15_~{SHDN}
POWER_SUPLLY_FUSED: C24.1 Q3.5(D) Q3.6(D) Q3.7(D) Q3.8(D) Q7.5(D) Q7.6(D) Q7.7(D) Q7.8(D) R20.1 U6.24(V1) ; port POWER_SUPLLY_FUSED
VG_1: C19.1 D3.2(K) Q1.4(G) Q3.4(G) Q5.4(G) Q7.4(G) R14.1 TP2.TP
VG_2: C20.1 D4.2(K) Q2.4(G) Q4.4(G) Q6.4(G) Q8.4(G) R15.1 TP1.TP
VG_3: C21.1 D5.2(K) Q9.4(G) Q10.4(G) Q11.4(G) Q12.4(G) R16.1 TP3.TP
VS_1: C16.1 Q1.1(S) Q1.2(S) Q1.3(S) Q3.1(S) Q3.2(S) Q3.3(S) Q5.1(S) Q5.2(S) Q5.3(S) Q7.1(S) Q7.2(S) Q7.3(S) U6.21(VS1)
VS_2: C17.1 Q2.1(S) Q2.2(S) Q2.3(S) Q4.1(S) Q4.2(S) Q4.3(S) Q6.1(S) Q6.2(S) Q6.3(S) Q8.1(S) Q8.2(S) Q8.3(S) U6.19(VS2)
VS_3: C18.1 Q9.1(S) Q9.2(S) Q9.3(S) Q10.1(S) Q10.2(S) Q10.3(S) Q11.1(S) Q11.2(S) Q11.3(S) Q12.1(S) Q12.2(S) Q12.3(S) U6.17(VS3)
NetC27_1: C27.1 Q14.3(D) R23.2 R27.1 U6.8(UV3)
NetD3_1: D3.1(A) R14.2 U6.20(G1)
NetD4_1: D4.1(A) R15.2 U6.18(G2)
NetD5_1: D5.1(A) R16.2 U6.16(G3)
NetQ14_1: Q14.1(G) ; port AUX switch
NetR20_2: R20.2 R22.1 U6.4(UV1)
NetR21_2: R21.2 R26.1 U6.6(UV2)
NetR22_2: R22.2 R25.2 U6.5(OV1)
NetR24_1: R24.1 U6.3(HYS)
NetR26_2: R26.2 R28.1 U6.7(OV2)
NetR27_2: R27.2 R29.1 U6.9(OV3)

Not connected (* = marked no-connect by the designer): U6 14(CAS)*

### Layout directives
net class HighCurrent; rule Power Plane Connect Style [Style - Direct Connect]; rule Polygon Connect Style [Style - Direct Connect]: VBAT, VS_1, VS_2, VS_3

### Notes on the sheet
- (near C16) Rds/MOSFET: 0.0085Ohms
  Total Rds: 0.00566666Ohms
- (near Q8) Rds/MOSFET: 0.0085Ohms
  Total Rds: 0.00566666Ohms
- ESR: 74mOhms
  SRC R: 200mOhms (From AUX)
- (near C18) Rds/MOSFET: 0.0085Ohms
  Total Rds: 0.0085Ohms
- PROJECT
- DOCUMENT
- DRAWN BY
- LAST MODIFIED
- PART NUMBER
- REVISION
- SHEET
- VARIANT
- OF
- Engineering 5 - 1002
  University of Waterloo
  (519) 888-4567 x32978
  hardware@uwmidsun.com
- (in symbol CMP-013-0003-1) +

### Library data of the parts
C16-C18 = CMP-013-0033-1: 20pF ±5% 50V Ceramic Capacitor C0G, NP0 0603 (1608 Metric); Manufacturer 1: Murata Electronics North America; Manufacturer Part Number 1: GRM1885C1H200JA01D; Package / Case: 0603 (1608 Metric); Packaging: Cut Tape (CT); Design Item ID: CAP CER 20PF 50V ±5% C0G/NP0 0603; Part Status: Active; Size / Dimension: 0.063" L x 0.031" W (1.60mm x 0.80mm); Lead Style: -; Source: Schematic Diagrams.SchLib; Operating Temperature: -55°C ~ 125°C; Tolerance: 5%; Ratings: -; ComponentLink1URL: http://www.murata.com/~/media/webrenewal/support/library/catalog/products/capacitor/mlcc/c02e.ashx; ComponentLink1Description: http://www.murata.com/~/media/webrenewal/support/library/catalog/products/capacitor/mlcc/c02e.ashx; Mounting Type: Surface Mount, MLCC; Lead Spacing: -; Thickness (Max): 0.035" (0.90mm); Height - Seated (Max): -
C19-C21 = CMP-001-00085-4: 2pF ±0.25pF 50V Ceramic Capacitor C0G, NP0 0603 (1608 Metric); Manufacturer Part Number 1: CGA3E2C0G1H020C080AA; Termination: SMD/SMT; Packaging: Tape and Reel; Package Quantity: 4000; Thickness: 0.035inch; Mount: Surface Mount; Weight: 7.1E-05oz; Case Code (Imperial): 0603; Voltage Rating: 50V; Composition: Ceramic; Length: 1.6mm; Max Operating Temperature: 125°C; Width: 0.031inch; Case Code (Metric): 1608; Depth: 0.8mm; Height: 0.8mm; Ratings: AEC-Q200; Min Operating Temperature: -55°C; Dielectric: C0G; Case/Package: 0603
C22 = CMP-013-0003-1: 100µF 35V Aluminum Electrolytic Capacitors Radial, Can - SMD 2000 Hrs @ 85°C; Manufacturer Part Number 1: EEE-1VA101XP; Manufacturer 1: Panasonic; Ripple Current (AC): 132mA; Description 1: Cap Aluminum Lytic 100uF 35V 20% (6.3 X 7.7mm) SMD 132mA 2000h 85C Automotive T/R; Life (Hours): 2000Hour; Polarity: Polar; Leakage Current: 3uA; Mount: Surface Mount,PCB; ComponentLink1URL: https://datasheet.ciiva.com/46378/aba0000ce2-46378341.pdf; Height - Seated (Max): 0.303inch; Design Item ID: CAP ALUM 100UF 20% 35V SMD; ComponentLink6Description: https://datasheet.ciiva.com/14591/70255710-14591771.pdf; Packaging: Tape and Reel; ComponentLink3URL: https://datasheet.ciiva.com/30170/11aba0000ce2-30170103.pdf; Source: Schematic Diagrams.SchLib; Height: 7.7mm; Lead Free: Lead Free; ComponentLink3Description: https://datasheet.ciiva.com/30170/11aba0000ce2-30170103.pdf; Stock 1: 170823; Package Quantity: 900; ComponentLink8URL: https://datasheet.ciiva.com/46374/aba0000ce2-46374427.pdf; Min Operating Temperature: -40°C; ComponentLink9URL: https://datasheet.ciiva.com/11673/aba0000ce2-11673887.pdf; ComponentLink7URL: https://datasheet.ciiva.com/14600/70255710-14600731.pdf; Diameter: 6.3mm; Case/Package: Radial; Pricing 1: 1=0.44, 10=0.304, 100=0.1822 (USD); ComponentLink4URL: https://datasheet.ciiva.com/31414/aba0000ce2-31414696.pdf; ComponentLink5Description: https://datasheet.ciiva.com/24068/aba0000ce2-40801-24068089.pdf; REACH SVHC: No SVHC; ComponentLink2URL: https://datasheet.ciiva.com/17535/aba0000ce2-17535510.pdf; ComponentLink5URL: https://datasheet.ciiva.com/24068/aba0000ce2-40801-24068089.pdf; Voltage: 35V; Length: 8mm; ComponentLink6URL: https://datasheet.ciiva.com/14591/70255710-14591771.pdf; Termination: SMD/SMT; ComponentLink4Description: https://datasheet.ciiva.com/31414/aba0000ce2-31414696.pdf; Contact Plating: Tin; Pins: 8; Max Operating Temperature: 85°C; Radiation Hardening: No; ComponentLink1Description: https://datasheet.ciiva.com/46378/aba0000ce2-46378341.pdf; Ripple Current: 132mA; ComponentLink2Description: https://datasheet.ciiva.com/17535/aba0000ce2-17535510.pdf; ComponentLink8Description: https://datasheet.ciiva.com/46374/aba0000ce2-46374427.pdf; ComponentLink7Description: https://datasheet.ciiva.com/14600/70255710-14600731.pdf; Voltage Rating (DC): 35V; ComponentLink9Description: https://datasheet.ciiva.com/11673/aba0000ce2-11673887.pdf
C23-C26 = CAP CER 0.1UF 50V 10% X7R 0603: as C5 on sheet Power Selection - AUX; Supplier 1: Digi-Key; Supplier Part Number 1: 478-5052-1-ND; Packaging: Cut Tape (CT); Part Status: Active; Operating Temperature: -55°C ~ 125°C; Ratings: -; Mounting Type: Surface Mount, MLCC; Package / Case: 0603 (1608 Metric); Size / Dimension: 0.063" L x 0.032" W (1.60mm x 0.81mm); Height - Seated (Max): -; Thickness (Max): 0.035" (0.90mm); Lead Spacing: -; Lead Style: -; ComponentLink1URL: http://datasheets.avx.com/X7RDielectric.pdf; ComponentLink1Description: http://datasheets.avx.com/X7RDielectric.pdf; Tolerance: ±10%; Voltage: 50V
C27 = CAP CER 10nF 50V 5% X7R 0603: as C6 on sheet Power Selection - AUX; Supplier 1: Digi-Key; Supplier Part Number 1: 399-13384-1-ND; Packaging: Cut Tape (CT); Part Status: Active; Operating Temperature: -55°C ~ 125°C; Ratings: -; Failure Rate: -; Mounting Type: Surface Mount, MLCC; Package / Case: 0603 (1608 Metric); Size / Dimension: 0.063" L x 0.032" W (1.60mm x 0.80mm); Height - Seated (Max): -; Thickness (Max): 0.034" (0.87mm); Lead Spacing: -; Lead Style: -; ComponentLink1URL: http://www.kemet.com/docfinder?Partnumber=C0603C103J5JAC7867; ComponentLink1Description: http://www.kemet.com/docfinder?Partnumber=C0603C103J5JAC7867; Tolerance: ±5%
D3-D5 = DIODE SCHOTTKY 30V 1A POWERDI123: Diode Schottky 30V 1A Surface Mount PowerDI™ 123; Manufacturer: Diodes Incorporated; Manufacturer Part Number: DFLS130L-7; Speed: Fast Recovery =< 500ns, > 200mA (Io); Current - Reverse Leakage @ Vr: 1mA @ 30V; Capacitance @ Vr, F: 76pF @ 10V, 1MHz; Supplier 1: Digi-Key; RoHS: RoHS Compliant; Category: Discrete Semiconductor Products; Stock 1: 68200; Packaging: Cut Tape (CT); Part Status: Active; Diode Type: Schottky; Mounting Type: Surface Mount; Package / Case: POWERDI®123; Supplier Device Package: PowerDI™ 123; Operating Temperature - Junction: -40°C ~ 125°C; ComponentLink1URL: https://www.diodes.com/assets/Datasheets/ds30492.pdf; ComponentLink1Description: https://www.diodes.com/assets/Datasheets/ds30492.pdf; Supplier Part Number 1: DFLS130LDICT-ND; Pricing 1: 1=0.7, 10=0.599, 100=0.447, 500=0.35126, 1000=0.27142 (CAD); Current - Average Rectified (Io): 1A
Q1-Q12 = MOSFET P-CH PWR56 40V 4.9 MOHM: P-Channel 16V 2.5A (Ta) 650mW (Ta) Surface Mount X2-DFN2015-3; Current - Continuous Drain (Id) @ 25°C: 80A (Tc); Drive Voltage (Max Rds On,  Min Rds On): 4.5V, 10V; Vgs(th) (Max) @ Id: 3V @ 250µA; Gate Charge (Qg) (Max) @ Vgs: 107nC @ 10V; Input Capacitance (Ciss) (Max) @ Vds: 4840pF @ 20V; Power Dissipation (Max): 214W (Tj); Rds On (Max) @ Id, Vgs: 4.9mOhm @ 80A, 10V; Packaging: Cut Tape (CT); Part Status: Active; FET Type: P-Channel; Technology: MOSFET (Metal Oxide); Drain to Source Voltage (Vdss): 40V; Vgs (Max): ±16V; FET Feature: -; Operating Temperature: -55°C ~ 175°C (TJ); Mounting Type: Surface Mount; Supplier Device Package: FDWS9508L-F085OSCT-ND; Package / Case: 8-PowerTDFN; ComponentLink1URL: https://www.onsemi.com/pub/Collateral/FDWS9508L-F085-D.PDF; ComponentLink1Description: https://www.onsemi.com/pub/Collateral/FDWS9508L-F085-D.PDF; Supplier 1: Digi-Key; Supplier Part Number 1: FDWS9508L-F085OSCT-ND
Q14 = CMP-003-0074-1: N-Channel 30V 6.2A (Ta) 900mW (Ta) Surface Mount SOT-23; Manufacturer: Diodes; Manufacturer Part Number: DMN3023L-7; Input Capacitance: 873pF; Rds On Max: 25mR; Pricing 1: 1=0.47, 10=0.368, 100=0.2529, 500=0.1734, 1000=0.1301 (USD); Stock 1: 38246; ComponentLink1URL: https://www.diodes.com/assets/Datasheets/DMN3023L.pdf; Continuous Drain Current (ID): 6.2A; Max Operating Temperature: 150°C; Packaging: Tape and Reel; ComponentLink2URL: http://www.mouser.com/ds/2/115/DMN3023L-959533.pdf; Min Operating Temperature: -55°C; ComponentLink1Description: https://www.diodes.com/assets/Datasheets/DMN3023L.pdf; ComponentLink2Description: http://www.mouser.com/ds/2/115/DMN3023L-959533.pdf; Source: Schematic Diagrams.SchLib; Drain to Source Voltage (Vdss): 30V; Case/Package: TO-236-3; Design Item ID: MOSFET N-CH 30V 6.2A 0.9W SOT-23; Mount: Surface Mount
R14-R16 = RES 2.21K OHM 1% 1/10W 0603: 2.21 kOhms ±1% 0.1W, 1/10W Chip Resistor 0603 (1608 Metric) Automotive AEC-Q200, Moisture Resistant Thick Film; Manufacturer: Yageo; Manufacturer Part Number: AC0603FR-072K21L; Voltage Rating: 50V; Resistance: 2.21kR; Temperature Coefficient: 100ppm/°C; Working Voltage: 75V; Supplier 1: Digi-Key; Stock 1: 11020; Pricing 1: 1=0.1, 10=0.029, 100=0.0117, 1000=0.00527, 2500=0.00458 (USD); Case/Package: 0603; Weight: 7.1E-05oz; Case Code (Imperial): 0603; Case Code (Metric): 1608; Min Operating Temperature: -55°C; Max Operating Temperature: 155°C; Power Rating: 100mW; Packaging: Tape and Reel; Composition: Thick Film; Termination: SMD/SMT; Number of Terminations: 2; Length: 0.063inch; Height: 0.022inch; Width: 0.8mm; Lead Free: Lead Free; ComponentLink1URL: https://datasheet.ciiva.com/12576/pyu-ac-51-rohs-l-2-12576458.pdf; ComponentLink1Description: https://datasheet.ciiva.com/12576/pyu-ac-51-rohs-l-2-12576458.pdf; Supplier Part Number 1: YAG3586CT-ND
R17-R19 = RES 10K OHM 1% 1/10W 0603: as R7 on sheet Power Selection - AUX; Supplier 1: Digi-Key; Supplier Part Number 1: 311-10.0KHRCT-ND; Packaging: Cut Tape (CT); Part Status: Active; Composition: Thick Film; Operating Temperature: -55°C ~ 155°C; Package / Case: 0603 (1608 Metric); Supplier Device Package: 0603; Size / Dimension: 0.063" L x 0.031" W (1.60mm x 0.80mm); Height - Seated (Max): 0.022" (0.55mm); Failure Rate: -; ComponentLink1URL: http://www.yageo.com/documents/recent/PYu-RC_Group_51_RoHS_L_7.pdf; ComponentLink1Description: http://www.yageo.com/documents/recent/PYu-RC_Group_51_RoHS_L_7.pdf
R20 R21 R23 = RES 1M OHM 1% 1/10W 0603: as R42 on sheet Power Selection - AUX; Supplier 1: Digi-Key; Supplier Part Number 1: 311-1.00MHRCT-ND; RoHS: RoHS Compliant; Category: Resistors; Stock 1: 2336711; Pricing 1: 1=0.16, 10=0.022, 100=0.0089, 1000=0.00402, 2500=0.00349 (CAD); Packaging: Cut Tape (CT); Part Status: Active; Composition: Thick Film; Features: Moisture Resistant; Operating Temperature: -55°C ~ 155°C; Package / Case: 0603 (1608 Metric); Supplier Device Package: 0603; Size / Dimension: 0.063" L x 0.031" W (1.60mm x 0.80mm); Height - Seated (Max): 0.022" (0.55mm); Failure Rate: -; ComponentLink1URL: http://www.yageo.com/documents/recent/PYu-RC_Group_51_RoHS_L_7.pdf; ComponentLink1Description: http://www.yageo.com/documents/recent/PYu-RC_Group_51_RoHS_L_7.pdf
R22 = RES 19.6K OHM 1% 1/10W 0603: 19.6 kOhms ±1% 0.1W, 1/10W Chip Resistor 0603 (1608 Metric) Automotive AEC-Q200 Thick Film; Supplier 1: Digi-Key; ComponentLink1Description: https://www.seielect.com/catalog/sei-rmcf_rmcp.pdf; ComponentLink1URL: https://www.seielect.com/catalog/sei-rmcf_rmcp.pdf; Supplier Part Number 1: RMCF0603FT19K6CT-ND
R24 = RES 255K OHM 1% 1/10W 0603: 255k Ohm ±1% 0.1W, 1/10W Chip Resistor 0603 (1608 Metric) Moisture Resistant Thick Film; Manufacturer 1: Yageo; Manufacturer Part Number 1: RC0603FR-07255KL; Description 1: RES SMD 255K OHM 1% 1/10W 0603; Temperature Coefficient: ±100ppm/°C; Supplier 1: Digi-Key; Supplier Part Number 1: 311-255KHRCT-ND; RoHS: RoHS Compliant; Category: Resistors; Stock 1: 106564; Pricing 1: 1=0.16, 10=0.022, 100=0.0089, 1000=0.00402, 2500=0.00349 (CAD); Packaging: Cut Tape (CT); Part Status: Active; Composition: Thick Film; Features: Moisture Resistant; Operating Temperature: -55°C ~ 155°C; Package / Case: 0603 (1608 Metric); Supplier Device Package: 0603; Size / Dimension: 0.063" L x 0.031" W (1.60mm x 0.80mm); Height - Seated (Max): 0.022" (0.55mm); Failure Rate: -; ComponentLink1URL: http://www.yageo.com/documents/recent/PYu-RC_Group_51_RoHS_L_7.pdf; ComponentLink1Description: http://www.yageo.com/documents/recent/PYu-RC_Group_51_RoHS_L_7.pdf
R25 R29 = RES SMD 75K OHM 0.1% 1/10W 0603: 75 kOhms ±0.1% 0.1W, 1/10W Chip Resistor 0603 (1608 Metric) Automotive AEC-Q200 Thin Film; Manufacturer: Panasonic Electronic Components; Manufacturer Part Number: AC0603FR-0775RL; Temperature Coefficient: ±25ppm/°C; RoHS: RoHS Compliant; Category: Resistors; Packaging: Cut Tape (CT); Part Status: Active; Power (Watts): 0.1W, 1/10W; Composition: Thin Film; Features: Automotive AEC-Q200; Operating Temperature: -55°C ~ 155°C; Package / Case: 0603 (1608 Metric); Supplier Device Package: 0603; Size / Dimension: 0.063" L x 0.031" W (1.60mm x 0.80mm); Height - Seated (Max): 0.022" (0.55mm); Failure Rate: -; ComponentLink1URL: http://www.yageo.com/NewPortal/yageodocoutput?fileName=/pdf/R-Chip/PYu-AC_51_RoHS_L_6.pdf; ComponentLink1Description: http://www.yageo.com/NewPortal/yageodocoutput?fileName=/pdf/R-Chip/PYu-AC_51_RoHS_L_6.pdf; Supplier 1: Digi-Key; Supplier Part Number 1: P75KDBCT-ND
R26 = RES 29.4K OHM 1% 1/10W 0603: 29.4k Ohm ±1% 0.1W, 1/10W Chip Resistor 0603 (1608 Metric) Moisture Resistant Thick Film; Manufacturer 1: Yageo; Manufacturer Part Number 1: RC0603FR-0729K4L; Description 1: RES SMD 29.4K OHM 1% 1/10W 0603; Temperature Coefficient: ±100ppm/°C; Supplier 1: Digi-Key; Supplier Part Number 1: 311-29.4KHRCT-ND; RoHS: RoHS Compliant; Category: Resistors; Stock 1: 76118; Pricing 1: 1=0.16, 10=0.022, 100=0.0089, 1000=0.00402, 2500=0.00349 (CAD); Packaging: Cut Tape (CT); Part Status: Active; Composition: Thick Film; Features: Moisture Resistant; Operating Temperature: -55°C ~ 155°C; Package / Case: 0603 (1608 Metric); Supplier Device Package: 0603; Size / Dimension: 0.063" L x 0.031" W (1.60mm x 0.80mm); Height - Seated (Max): 0.022" (0.55mm); Failure Rate: -; ComponentLink1URL: http://www.yageo.com/documents/recent/PYu-RC_Group_51_RoHS_L_7.pdf; ComponentLink1Description: http://www.yageo.com/documents/recent/PYu-RC_Group_51_RoHS_L_7.pdf; Tolerance: ±1%
R27 = RES SMD 44.2K OHM 1% 1/10W 0603: 44.2 kOhms ±1% 0.1W, 1/10W Chip Resistor 0603 (1608 Metric) Automotive AEC-Q200 Thick Film; Supplier 1: Digi-Key; Supplier Part Number 1: P44.2KHCT-ND; ComponentLink1Description: https://industrial.panasonic.com/cdbs/www-data/pdf/RDA0000/AOA0000C304.pdf; ComponentLink1URL: https://industrial.panasonic.com/cdbs/www-data/pdf/RDA0000/AOA0000C304.pdf
R28 = RES 76.8K OHM 1% 1/10W 0603: 76.8 kOhms ±1% 0.1W, 1/10W Chip Resistor 0603 (1608 Metric) Automotive AEC-Q200 Thick Film; ComponentLink1Description: https://www.seielect.com/catalog/sei-rmcf_rmcp.pdf; ComponentLink1URL: https://www.seielect.com/catalog/sei-rmcf_rmcp.pdf; Supplier 1: Digi-Key; Supplier Part Number 1: RMCF0603FT76K8CT-ND
U6 = IC OR CONTROLLER SOURCE SELECT 24SSOP: OR Controller Source Selector Switch P-Channel 3:1 24-SSOP; Manufacturer 1: Linear Technology; Internal Switch(s): No; Current - Supply: 28µA; Voltage - Supply: 2.5 V ~ 36 V; Supplier 1: Digi-Key; Supplier Part Number 1: LTC4417CGN#PBF-ND; Packaging: Tube; Part Status: Active; Type: Source Selector Switch; FET Type: P-Channel; Ratio - Input:Output: 3:1; Current - Output (Max): -; Operating Temperature: 0°C ~ 70°C; Mounting Type: Surface Mount; Package / Case: 24-SSOP (0.154", 3.90mm Width); Supplier Device Package: 24-SSOP; ComponentLink1URL: http://www.linear.com/docs/42408; ComponentLink1Description: http://www.linear.com/docs/42408

## Nets that join several sheets
3V3: Controller_Board_Interface (10 pins), Power Selection - Power Path (R17.1 R18.1 R19.1)
GND: Controller_Board_Interface (5 pins), Power Selection - Power Supply (D6.2 Power_Supply.2 R35.2), Power Selection - DC-DC (C10.2 D2.2 DCDC_Power.2), Power Selection - AUX (AUX_Power.2 C4.2 D1.2), Power Selection - Power Path (5 pins)
LDO_3V: Controller_Board_Interface (C3.1 LDO_3V.TP U1.5), Power Selection - Power Supply (C33.1 C35.1 U8.5 U9.5), Power Selection - DC-DC (5 pins), Power Selection - AUX (5 pins), Power Selection - Temperature Sense (C28.1 U7.8)
SIG_GND: Controller_Board_Interface (14 pins), Power Selection - Power Supply (11 pins), Power Selection - DC-DC (12 pins), Power Selection - AUX (13 pins), Power Selection - Temperature Sense (8 pins), Power Selection - Power Path (11 pins)
VBAT: Controller_Board_Interface (8 pins), Power Selection - Power Path (30 pins)
AUX_FUSED: Power Selection - AUX (AUX.TH_TP R2.2 U2.3), Power Selection - Power Path (11 pins)
DCDC_FUSED: Power Selection - DC-DC (DCDC.TH_TP R8.2 U4.3), Power Selection - Power Path (11 pins)
NetAUX_Signals_1: Power Selection - AUX (AUX_Signals.1), Power Selection - Temperature Sense (C31.1 R33.1 U7.5)
NetC29_1: Power Selection - DC-DC (DCDC_Signals.3), Power Selection - Temperature Sense (C29.1 R31.1 U7.3)
NetQ14_1: Power Selection - AUX (R41.2), Power Selection - Power Path (Q14.1)
PA0_AUX_VSENSE: Controller_Board_Interface (P1.25), Power Selection - AUX (C9.1 R5.2)
PA1_DCDC_VSENSE: Controller_Board_Interface (P1.24), Power Selection - DC-DC (C15.1 R11.2)
PA2_PWR_SUP_VSENSE: Controller_Board_Interface (P1.23), Power Selection - Power Supply (C37.1 R38.2)
PA3_AUX_TEMP: Controller_Board_Interface (P1.22), Power Selection - Temperature Sense (C32.1 R32.2)
PA4_DCDC_TEMP: Controller_Board_Interface (P1.21), Power Selection - Temperature Sense (C30.1 R30.2)
PA5_AUX_ISENSE: Controller_Board_Interface (P1.20), Power Selection - AUX (C6.1 R3.2)
PA6_DCDC_ISENSE: Controller_Board_Interface (P1.19), Power Selection - DC-DC (C12.1 R9.2)
PA7_PWR_SUP_ISENSE: Controller_Board_Interface (P1.18), Power Selection - Power Supply (C34.1 R36.2)
PA8_EN: Controller_Board_Interface (P1.32), Power Selection - Power Path (U6.1)
PA8_~{VALID3}: Controller_Board_Interface (P1.7), Power Selection - Power Path (R19.2 U6.12)
PA9_~{VALID2}: Controller_Board_Interface (P1.6), Power Selection - Power Path (R18.2 U6.11)
PA10_~{VALID1}: Controller_Board_Interface (P1.5), Power Selection - Power Path (R17.2 U6.10)
PB0_DCDC_FAULT: Controller_Board_Interface (P1.17), Power Selection - DC-DC (DCDC_Signals.4)
PB15_~{SHDN}: Controller_Board_Interface (P1.8), Power Selection - Power Path (U6.2)
POWER_SUPLLY_FUSED: Power Selection - Power Supply (Q13.1 Q13.2 Q13.3), Power Selection - Power Path (11 pins)